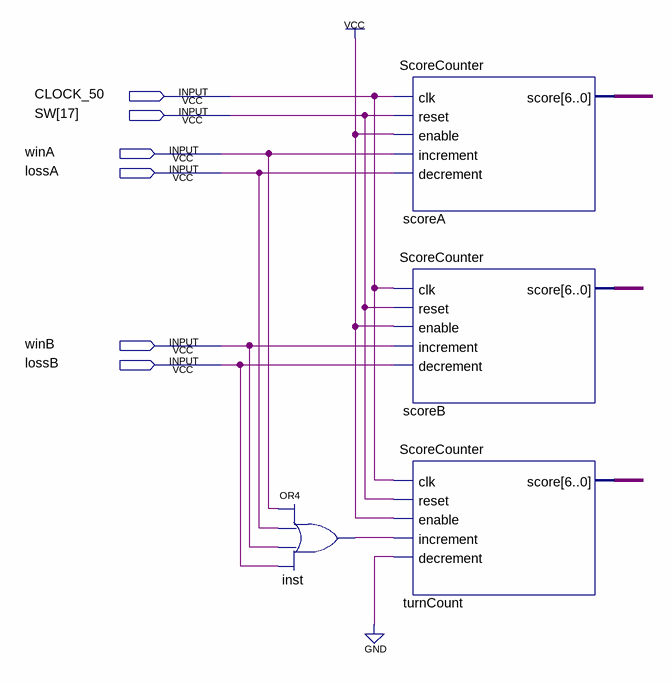
[diagram p0: schematic sheet]
// Quartus schematic scoreUnit_schematic.bdf as structural Verilog: 4 symbols, 6 pins
module scoreUnit_schematic (
  input  CLOCK_50,
  input  [17:17] SW,
  input  winA,
  input  lossA,
  input  winB,
  input  lossB
);

  wire inst_out;
  wire [6:0] scoreA_score, scoreB_score, turnCount_score;

  or inst (inst_out, winA, lossA, winB, lossB);
  ScoreCounter scoreA (
    .clk(CLOCK_50), .reset(SW[17]), .enable(1'b1), .increment(winA), .decrement(lossA), .score(scoreA_score));
  ScoreCounter scoreB (
    .clk(CLOCK_50), .reset(SW[17]), .enable(1'b1), .increment(winB), .decrement(lossB), .score(scoreB_score));
  ScoreCounter turnCount (
    .clk(CLOCK_50), .reset(SW[17]), .enable(1'b1), .increment(inst_out), .decrement(1'b0),
    .score(turnCount_score));
endmodule
